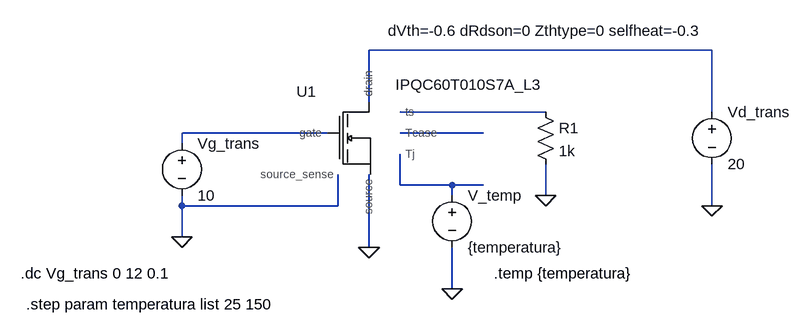
[diagram p0: schematic Si_MOSFET_trans.asc]
Si_MOSFET_trans.asc, the LTspice schematic file:
Version 4.1
SHEET 1 2716 680
WIRE 736 32 208 32
WIRE 208 112 208 32
WIRE 480 128 256 128
WIRE 736 128 736 32
WIRE 144 160 -80 160
WIRE 384 160 256 160
WIRE -80 176 -80 160
WIRE 256 240 256 192
WIRE 336 240 256 240
WIRE 384 240 336 240
WIRE 336 256 336 240
WIRE 480 256 480 208
WIRE -80 272 -80 256
WIRE 160 272 160 224
WIRE 160 272 -80 272
WIRE 736 272 736 208
WIRE -80 320 -80 272
WIRE 208 336 208 224
WIRE 336 400 336 336
FLAG -80 320 0
FLAG 736 272 0
FLAG 208 336 0
FLAG 480 256 0
FLAG 336 400 0
SYMBOL IPQC60T010S7_L3 208 176 R0
WINDOW 39 273 -189 Top 2
SYMATTR SpiceLine dVth=-0.6 dRdson=0 Zthtype=0 selfheat=-0.3
SYMATTR InstName U1
SYMBOL voltage -80 160 R0
WINDOW 123 0 0 Left 0
WINDOW 39 0 0 Left 0
SYMATTR InstName Vg_trans
SYMATTR Value 10
SYMBOL voltage 736 112 R0
WINDOW 123 0 0 Left 0
WINDOW 39 0 0 Left 0
SYMATTR InstName Vd_trans
SYMATTR Value 20
SYMBOL res 464 112 R0
SYMATTR InstName R1
SYMATTR Value 1k
SYMBOL voltage 336 240 R0
WINDOW 123 0 0 Left 0
WINDOW 39 0 0 Left 0
SYMATTR InstName V_temp
SYMATTR Value {temperatura}
TEXT -328 376 Left 2 !.dc Vg_trans 0 12 0.1
TEXT 400 376 Left 2 !.temp {temperatura}
TEXT -320 424 Left 2 !.step param temperatura list 25 150

The netlist it stands for:
* Si_MOSFET_trans.asc
X§U1 N001 N003 0 0 N002 N005 N004 IPQC60T010S7A_L3 dVth=-0.6 dRdson=0 Zthtype=0 selfheat=-0.3  ; pins drain gate source source_sense ts Tj Tcase
Vg_trans N003 0 10
Vd_trans N001 0 20
R1 N002 0 1k
V_temp N005 0 {temperatura}
.dc Vg_trans 0 12 0.1
.temp {temperatura}
.step param temperatura list 25 150
.lib IFX_S7A_TS_600V.lib
.backanno
.end